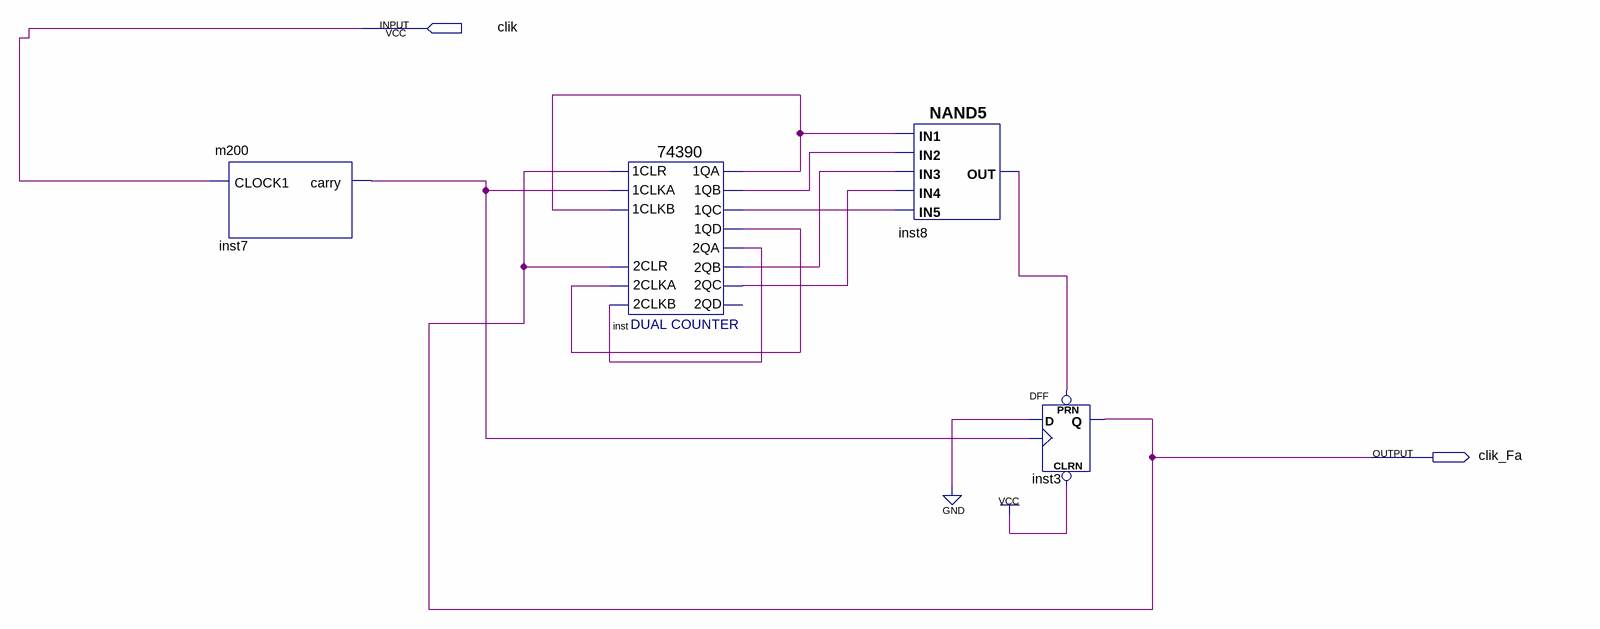
[diagram p0: schematic sheet]
// Quartus schematic Fa.bdf as structural Verilog: 4 symbols, 2 pins
module Fa (
  input  clik,
  output clik_Fa
);

  wire inst7_carry, inst8_out, inst_1qa, inst_1qb, inst_1qc, inst_1qd, inst_2qa, inst_2qb, inst_2qc;

  m200 inst7 (.CLOCK1(clik), .carry(inst7_carry));
  \74390  inst (
    .\2CLKA (inst_1qd), .\2CLR (clik_Fa), .\2CLKB (inst_2qa), .\1CLR (clik_Fa), .\1CLKA (inst7_carry),
    .\1CLKB (inst_1qa), .\1QA (inst_1qa), .\1QB (inst_1qb), .\1QC (inst_1qc), .\1QD (inst_1qd),
    .\2QA (inst_2qa), .\2QB (inst_2qb), .\2QC (inst_2qc));  // open: 2QD
  nand inst8 (inst8_out, inst_1qa, inst_1qb, inst_2qb, inst_2qc, inst_1qc);
  DFF inst3 (.CLRN(1'b1), .CLK(inst7_carry), .D(1'b0), .PRN(inst8_out), .Q(clik_Fa));
endmodule
